# EasyEDA Pro project luq_board.eprj, schematic SCH1
Create Date: 2024-01-28; Page Name: P1; Project Name: luq_board; Schematic Name: SCH1; Update Date: 2024-04-09; Drawed: luq; Page Size: A4; Version: V2.0
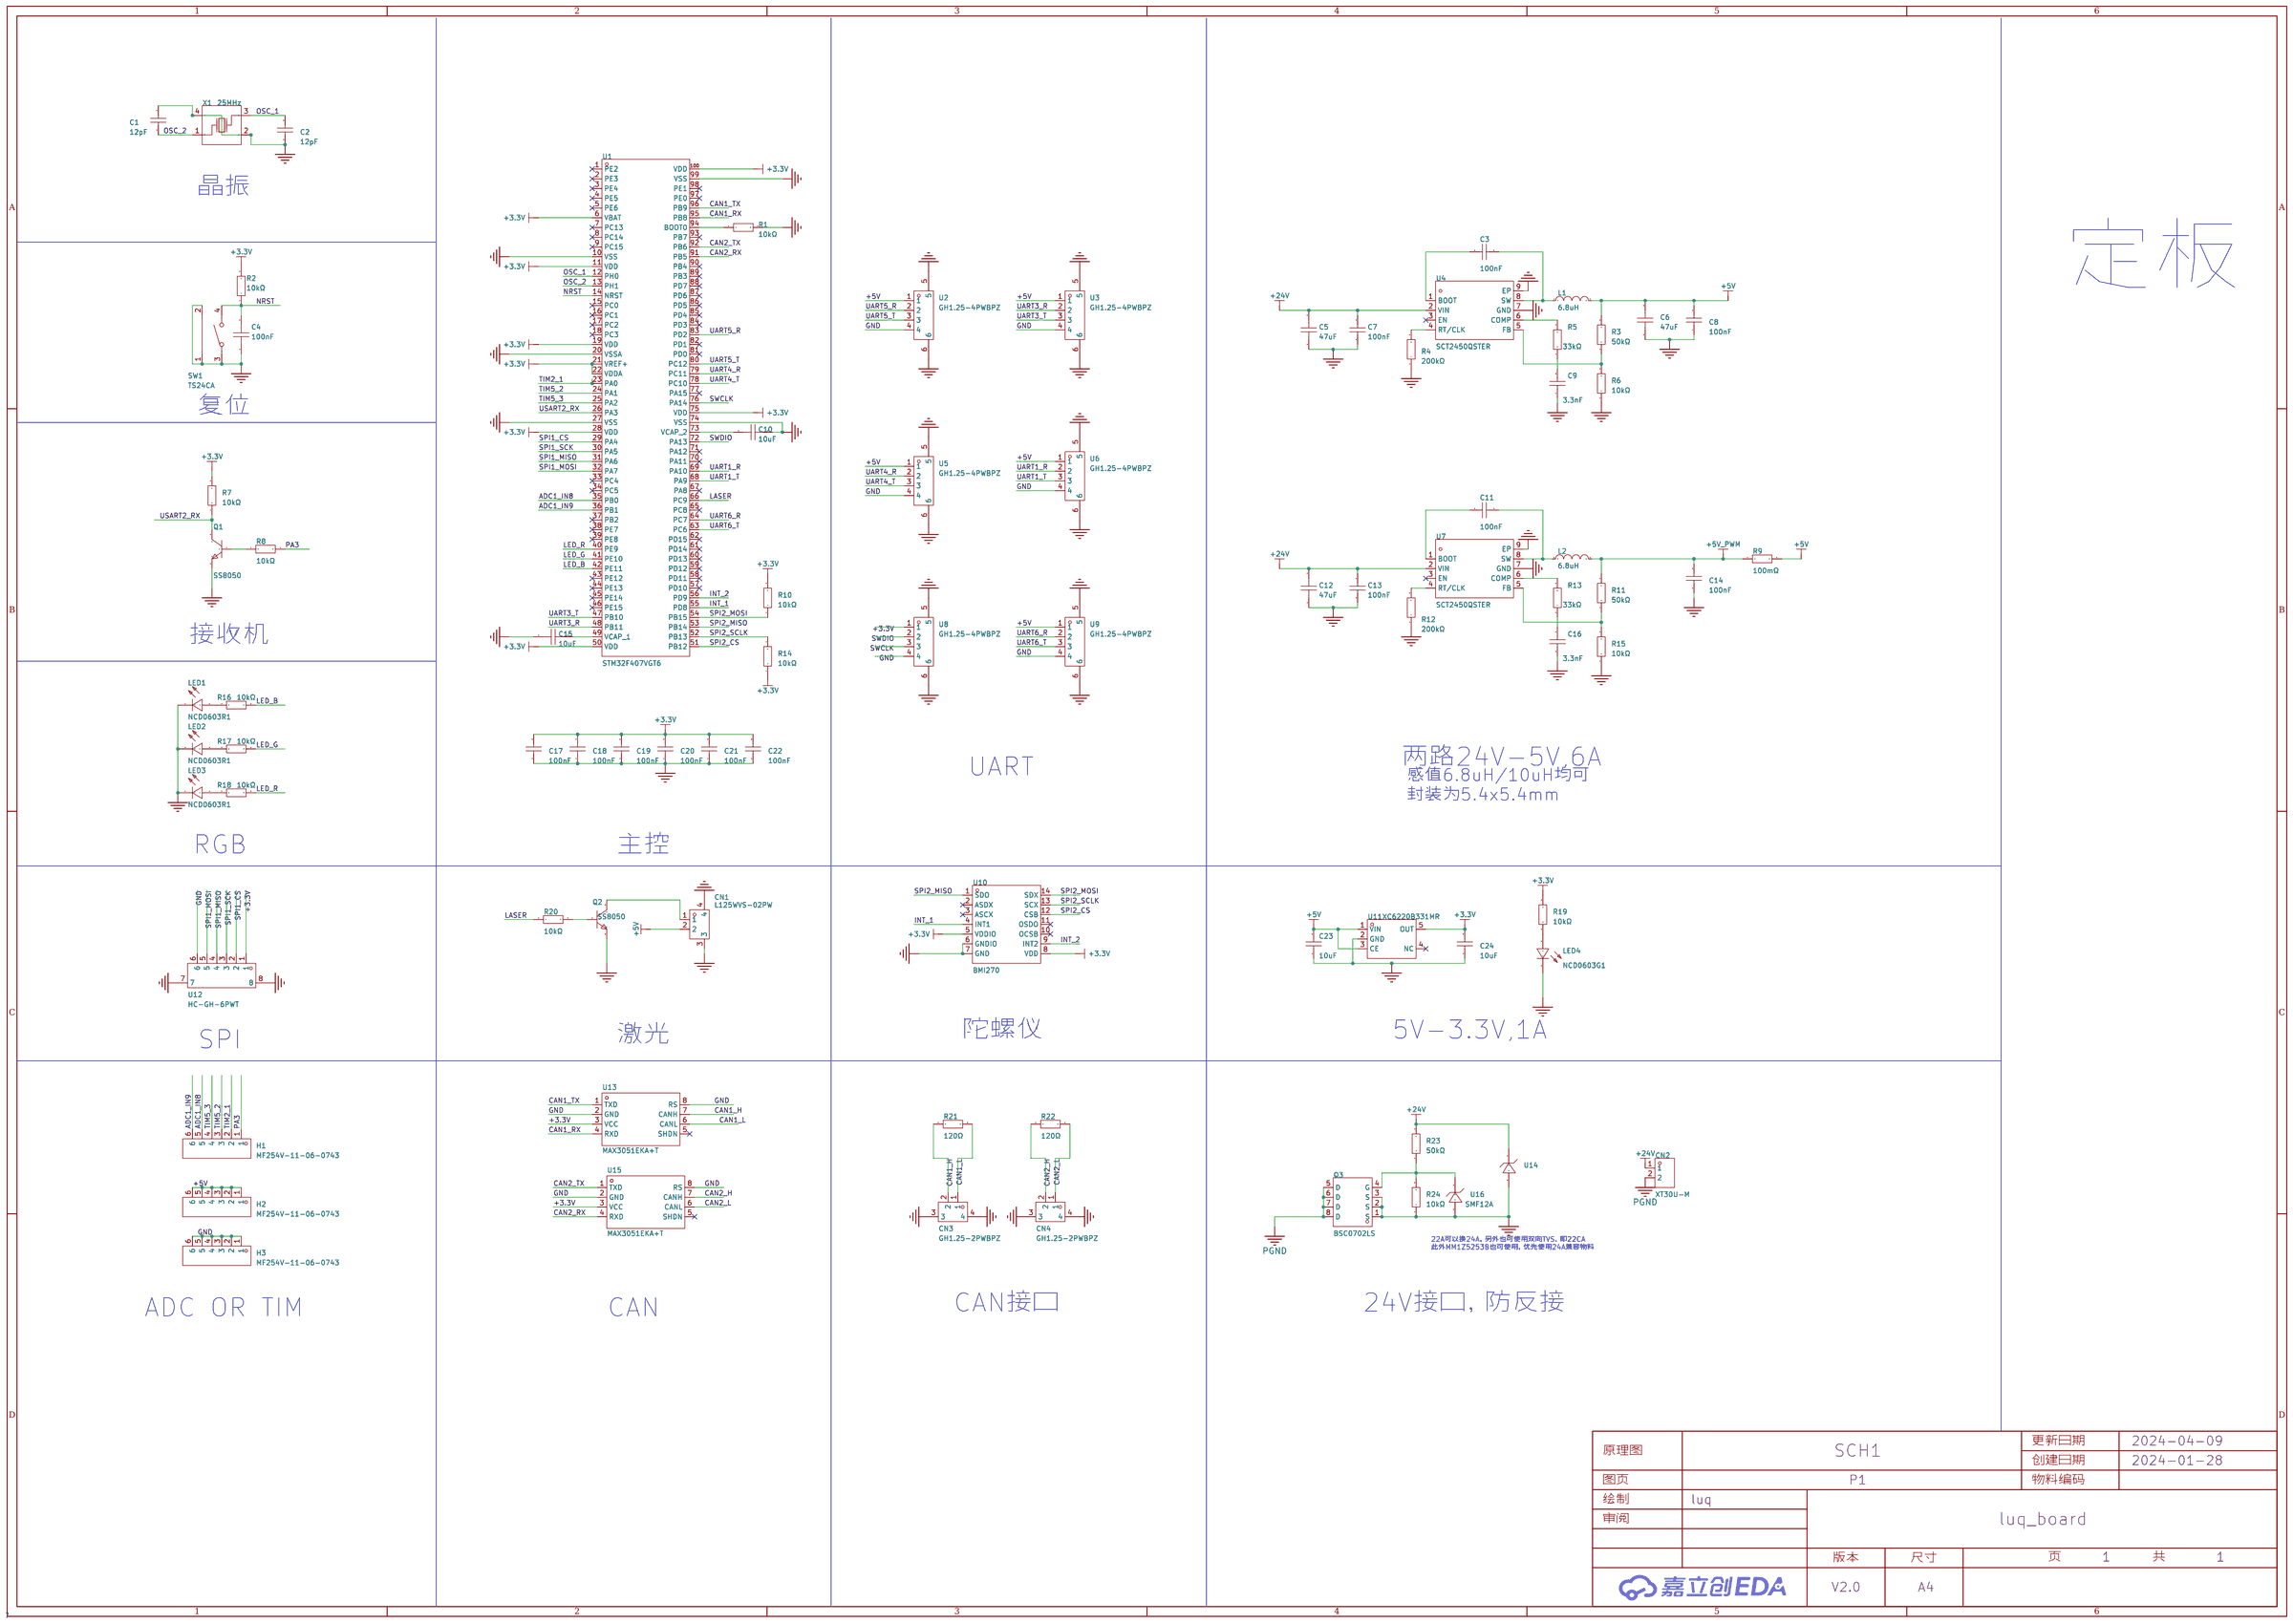
[diagram p0: schematic sheet]

## Parts
C1  12pF  [C0603]
C2  12pF  [C0603]
C3  100nF  [C0603]
C4  100nF  [C0603]
C5  47uF  [C1206]
C6  47uF  [C1206]
C7  100nF  [C0603]
C8  100nF  [C0603]
C9  3.3nF  [C0603]
C10  10uF  [C0603]
C11  100nF  [C0603]
C12  47uF  [C1206]
C13  100nF  [C0603]
C14  100nF  [C0603]
C15  10uF  [C0603]
C16  3.3nF  [C0603]
C17  100nF  [C0603]
C18  100nF  [C0603]
C19  100nF  [C0603]
C20  100nF  [C0603]
C21  100nF  [C0603]
C22  100nF  [C0603]
C23  10uF  [C0603]
C24  10uF  [C0603]
CN1  L125WVS-02PW  [CONN-SMD_2P-P1.25_DELON_L125WVS-02PW]
CN2  XT30U-M  [CONN-TH_XT30U-M]
CN3  GH1.25-2PWBPZ  [CONN-SMD_GH1.25-2PWBPZ]
CN4  GH1.25-2PWBPZ  [CONN-SMD_GH1.25-2PWBPZ]
H1  MF254V-11-06-0743  [HDR-TH_6P-P2.54-V-F_MF254V-11-06-0743]
H2  MF254V-11-06-0743  [HDR-TH_6P-P2.54-V-F_MF254V-11-06-0743]
H3  MF254V-11-06-0743  [HDR-TH_6P-P2.54-V-F_MF254V-11-06-0743]
L1  6.8uH  [IND-SMD_L5.4-W5.2_FXL0530]
L2  6.8uH  [IND-SMD_L5.4-W5.2_FXL0530]
LED1  NCD0603R1  [LED0603-RD_RED]
LED2  NCD0603R1  [LED0603-RD_RED]
LED3  NCD0603R1  [LED0603-RD_RED]
LED4  NCD0603G1  [LED0603-RD]
Q1  SS8050  [S8050_SOT-23]
Q2  SS8050  [S8050_SOT-23]
Q3  BSC0702LS  [PG-TDSON-8_L5.0-W6.0-P1.27-BL-EP]
R1  10kΩ  [R0603]
R2  10kΩ  [R0603]
R3  50kΩ  [R0603]
R4  200kΩ  [R0603]
R5  33kΩ  [R0603]
R6  10kΩ  [R0603]
R7  10kΩ  [R0603]
R8  10kΩ  [R0603]
R9  100mΩ  [R1206]
R10  10kΩ  [R0603]
R11  50kΩ  [R0603]
R12  200kΩ  [R0603]
R13  33kΩ  [R0603]
R14  10kΩ  [R0603]
R15  10kΩ  [R0603]
R16  10kΩ  [R0603]
R17  10kΩ  [R0603]
R18  10kΩ  [R0603]
R19  10kΩ  [R0603]
R20  10kΩ  [R0603]
R21  120Ω  [R0603]
R22  120Ω  [R0603]
R23  50kΩ  [R0603]
R24  10kΩ  [R0603]
SW1  TS24CA  [SW-SMD_TS24CA]
U1  STM32F407VGT6  [LQFP-100_L14.0-W14.0-P0.50-LS16.0-BL]
U2  GH1.25-4PWBPZ  [CONN-SMD_GH1.25-4PWBPZ]
U3  GH1.25-4PWBPZ  [CONN-SMD_GH1.25-4PWBPZ]
U4  SCT2450QSTER  [ESOP-8_L4.9-W3.9-P1.27-LS6.0-BL-EP]
U5  GH1.25-4PWBPZ  [CONN-SMD_GH1.25-4PWBPZ]
U6  GH1.25-4PWBPZ  [CONN-SMD_GH1.25-4PWBPZ]
U7  SCT2450QSTER  [ESOP-8_L4.9-W3.9-P1.27-LS6.0-BL-EP]
U8  GH1.25-4PWBPZ  [CONN-SMD_GH1.25-4PWBPZ]
U9  GH1.25-4PWBPZ  [CONN-SMD_GH1.25-4PWBPZ]
U10  BMI270  [LGA-14_L3.0-W2.5-P0.50-BR]
U11  XC6220B331MR  [SOT-23-5_L2.9-W1.6-P0.95-LS2.8-BR]
U12  HC-GH-6PWT  [CONN-SMD_6P-P1.25_HCTL_HC-GH-6PWT]
U13  MAX3051EKA+T  [SOT-23-8_L3.0-W1.7-P0.65-LS2.8-TL]
U14  SMF22A  [SOD-123FL_L2.8-W1.9-LS3.7-RD]
U15  MAX3051EKA+T  [SOT-23-8_L3.0-W1.7-P0.65-LS2.8-TL]
U16  SMF12A  [SOD-123FL_L2.7-W1.8-LS3.7-RD]
X1  25MHz  [OSC-SMD_4P-L3.2-W2.5-BL]

## Library data of the parts
C1 C2 = CL10C120JB8NNNC: 容值:12pF;精度:±5%;额定电压:50V;材质(温度系数):C0G;; LCSC Part Name: 12pF ±5% 50V; Supplier Part: C38523; Manufacturer: SAMSUNG(三星); Supplier Footprint: 0603; JLCPCB Part Class: 基础库; Datasheet: https://atta.szlcsc.com/upload/public/pdf/source/20160218/1457707763339.pdf; Supplier: LCSC; Tolerance: ±5%; Voltage Rated: 50V; Temperature Coefficient: C0G
C3 C7 C8 C11 C13 C14 C17-C22 = CC0603KRX7R9BB104: 容值:100nF;精度:±10%;额定电压:50V;材质(温度系数):X7R;; LCSC Part Name: 100nF ±10% 50V; Supplier Part: C14663; Manufacturer: YAGEO(国巨); Supplier Footprint: 0603; JLCPCB Part Class: Basic Part; Datasheet: https://atta.szlcsc.com/upload/public/pdf/source/20180910/C282072_33301C7F631E79921B82A8DAC6BCC5B3.pdf; Supplier: LCSC; Tolerance: ±10%; Voltage Rated: 50V; Temperature Coefficient: X7R
C4 = CC0603KRX7R9BB104: 容值:100nF;精度:±10%;额定电压:50V;材质(温度系数):X7R;; LCSC Part Name: 100nF ±10% 50V; Supplier Part: C14663; Manufacturer: YAGEO(国巨); Supplier Footprint: 0603; JLCPCB Part Class: 基础库; Datasheet: https://atta.szlcsc.com/upload/public/pdf/source/20180910/C282072_33301C7F631E79921B82A8DAC6BCC5B3.pdf; Supplier: LCSC; Tolerance: ±10%; Voltage Rated: 50V; Temperature Coefficient: X7R
C5 C6 C12 = GRM31CR61E476ME44L: 容值:47uF;精度:±20%;额定电压:25V;材质(温度系数):X5R;; LCSC Part Name: 47uF ±20% 25V; Supplier Part: C403725; Manufacturer: muRata(村田); Supplier Footprint: 1206; JLCPCB Part Class: Extended Part; Datasheet: https://atta.szlcsc.com/upload/public/pdf/source/20191025/C403725_B8A8CD2FFA1F57E6FDF268BD106459D5.pdf; Supplier: LCSC; Tolerance: ±20%; Voltage Rated: 25V; Temperature Coefficient: X5R
C9 C16 = CC0603KRX7R9BB332: 容值:3.3nF;精度:±10%;额定电压:50V;材质(温度系数):X7R;; LCSC Part Name: 3.3nF ±10% 50V; Supplier Part: C107088; Manufacturer: YAGEO(国巨); Supplier Footprint: 0603; JLCPCB Part Class: Extended Part; Datasheet: https://atta.szlcsc.com/upload/public/pdf/source/20180910/C282072_33301C7F631E79921B82A8DAC6BCC5B3.pdf; Supplier: LCSC; Tolerance: ±10%; Voltage Rated: 50V; Temperature Coefficient: X7R
C10 C15 C23 C24 = CL10A106MA8NRNC: 容值:10uF;精度:±20%;额定电压:25V;材质(温度系数):X5R;; LCSC Part Name: 10uF ±20% 25V; Supplier Part: C96446; Manufacturer: SAMSUNG(三星); Supplier Footprint: 0603; JLCPCB Part Class: Basic Part; Datasheet: https://atta.szlcsc.com/upload/public/pdf/source/20160218/1457707763339.pdf; Supplier: LCSC; Tolerance: ±20%; Voltage Rated: 25V; Temperature Coefficient: X5R
CN1 = L125WVS-02PW: 插针结构:1x2P;间距:1.25mm;公母:公;安装方式:卧贴;排数:1;每排PIN数:2;额定电流:1A;工作温度范围:-40℃~+110℃;; LCSC Part Name: 1x2P 间距:1.25mm 卧贴 GH1.25间距卧式贴片 2P 连接器; Supplier Part: C2998790; Manufacturer: DEALON(德艺隆); Supplier Footprint: SMD,P=1.25mm; JLCPCB Part Class: 扩展库; Datasheet: https://atta.szlcsc.com/upload/public/pdf/source/20220425/50B09E6409C3A2782C6D65104D18E34A.pdf; Supplier: LCSC; Pins Structure: 1x2P; Pitch: 1.25mm; Gender: 公; Mounting Style: 卧贴; Number of Rows: 1; Number of PINs Per Row: 2; Current Rating (Max): 1A; Operating Temperature Range: -40℃~+110℃
CN2 = XT30U-M: 模型插头轻量版锂电池插头; LCSC Part Name: AMASS(艾迈斯)轻量版锂电池插头公头 XT30U-M; Supplier Part: C99101; Manufacturer: AMASS(艾迈斯); JLCPCB Part Class: 扩展库; Datasheet: https://atta.szlcsc.com/upload/public/pdf/source/20170606/1496716542582.pdf; Supplier: LCSC
CN3 CN4 = GH1.25-2PWBPZ: LCSC Part Name: GH1.25-2P卧贴编带; Supplier Part: C2829251; Manufacturer: BOOMELE(博穆精密); JLCPCB Part Class: 扩展库; Datasheet: https://atta.szlcsc.com/upload/public/pdf/source/20211125/08A09A4909F58AF780B71FE423A00F7E.pdf; Supplier: LCSC
H1-H3 = MF254V-11-06-0743: 排数:单排;总孔位数:6P;间距:2.54mm;插孔结构:1x6P;行距:-;安装类型:直插;圆孔/方孔:圆孔;额定电流:3A;额定电压:60V;插孔方向:顶部;塑高:3mm;工作温度范围:-40℃~+105℃;; LCSC Part Name: 间距:2.54mm 1x6P 直插; Supplier Part: C962325; Manufacturer: XFCN(兴飞); Supplier Footprint: 插件,P=2.54mm; JLCPCB Part Class: 扩展库; Datasheet: https://atta.szlcsc.com/upload/public/pdf/source/20200408/C510959_8640BFA72E43E78C14C3EAA65BA5C05B.pdf; Supplier: LCSC; Number of Rows: 单排; Number of Holes: 6P; Pitch: 2.54mm; Holes Structure: 1x6P; Mounting Type: 直插; Circular Hole / Square Hole: 圆孔; Current Rating (Max): 3A; Voltage Rating (Max): 60V; Holes Direction: 顶部; Insulation Height: 3mm; Operating Temperature Range: -40℃~+105℃
L1 L2 = FXL0530-6R8-M: 电感值:6.8uH;精度:±20%;额定电流:3.5A;类型:一体成型电感;饱和电流(Isat):4A;; LCSC Part Name: 6.8uH ±20% 4A; Supplier Part: C177249; Manufacturer: cjiang(长江微电); Supplier Footprint: SMD,5.2x5.4mm; JLCPCB Part Class: Extended Part; Datasheet: https://atta.szlcsc.com/upload/public/pdf/source/20230516/4BF6F9C76E81720F52A39ED5FFFA18B4.pdf; Supplier: LCSC; Tolerance: ±20%; Rated Current: 3.5A; Type: 一体成型电感; DC Resistance (DCR): 90mΩ; Saturation Current (Isat): 4A
LED1-LED3 = NCD0603R1_C84263: 灯头类型:-;发光颜色:红色;正向电压(VF):1.6V~2.6V;功率:65mW;正向电流:20mA;主波长:615nm~630nm;二极管配置:独立二极管;透镜颜色:无色透明;色温:-;发光强度:80mcd~220mcd;发光角度:130°;载带方式:-;工作温度:-30℃~+85℃;; Supplier Part: C84263; Manufacturer: 国星光电; Supplier Footprint: 0603; JLCPCB Part Class: Extended Part; Datasheet: https://atta.szlcsc.com/upload/public/pdf/source/20200820/C84263_DABC6A75E58F576973B407FDBA283D60.pdf; Supplier: LCSC; Emitted Color: 红色; Forward Voltage (VF): 1.6V~2.6V; Power Dissipation: 65mW; Forward Current: 20mA; Dominant Wavelength: 615nm~630nm; Diode Configuration: 独立二极管; Lens Color: 无色透明; Luminous Intensity: 80mcd~220mcd; Viewing Angle: 130°; Operating Temperature: -30℃~+85℃
LED4 = NCD0603G1: 发光颜色:翠绿色;正向电压(VF):2.6V~3.6V;功率:72mW;正向电流:10mA;主波长:515nm~530nm;透镜颜色:无色透明;发光强度:330mcd~900mcd;发光角度:130°;工作温度:-30℃~+85℃;; Supplier Part: C84267; Manufacturer: 国星光电; Supplier Footprint: 0603; JLCPCB Part Class: 扩展库; Datasheet: https://atta.szlcsc.com/upload/public/pdf/source/20200820/C84267_04BA7703640BAC111D09F5EFB971FBF3.pdf; Supplier: LCSC; Emitted Color: 翠绿色; Forward Voltage (VF): 2.6V~3.6V; Power Dissipation: 72mW; Forward Current: 10mA; Dominant Wavelength: 515nm~530nm; Lens Color: 无色透明; Luminous Intensity: 330mcd~900mcd; Viewing Angle: 130°; Operating Temperature: -30℃~+85℃
Q1 Q2 = SS8050_C2150: 晶体管类型:NPN;集电极电流(Ic):1.5A;集射极击穿电压(Vceo):25V;功率(Pd):300mW;直流电流增益(hFE@Ic,Vce):200@100mA,1V;; LCSC Part Name: SS8050(RANGE:200-350) hfe=200~350; Supplier Part: C2150; Manufacturer: CJ(江苏长电/长晶); Supplier Footprint: SOT-23; JLCPCB Part Class: Basic Part; Datasheet: https://atta.szlcsc.com/upload/public/pdf/source/20230322/AEE86F4B043774EFF80CAEA14A37D9E9.pdf; Supplier: LCSC; Transistor Type: NPN; Collector Current (Ic): 1.5A; Collector-Emitter Breakdown Voltage (Vceo): 25V; Power Dissipation (Pd): 300mW; DC Current Gain (hFE@Ic,Vce): 200@100mA,1V; Transition Frequency (fT): 100MHz; Collector Cut-Off Current (Icbo): 100nA; Collector-Emitter Saturation Voltage (VCE(sat)@Ic,Ib): 500mV@800mA,80mA
Q3 = BSC0702LS: 类型:N沟道;漏源电压(Vdss):60V;连续漏极电流(Id):100A;功率(Pd):83W;导通电阻(RDS(on)@Vgs,Id):2.3mΩ@10V,50A;阈值电压(Vgs(th)@Id):2.3V@49uA;; LCSC Part Name: N沟道 耐压:60V 电流:100A; Supplier Part: C501503; Manufacturer: Infineon(英飞凌); Supplier Footprint: TDSON-8-EP(5x6); JLCPCB Part Class: 扩展库; Datasheet: https://atta.szlcsc.com/upload/public/pdf/source/20200324/C501503_BE3C55BAEEDCAD77F3934BFEE5415F86.pdf; Supplier: LCSC; Type: N沟道; Drain Source Voltage (Vdss): 60V; Continuous Drain Current (Id): 100A; Power Dissipation (Pd): 83W; Drain Source On Resistance (RDS(on)@Vgs,Id): 2.3mΩ@10V,50A; Gate Threshold Voltage (Vgs(th)@Id): 2.3V@49uA
R1 R2 = 0603WAF1002T5E: 电阻类型:厚膜电阻;阻值:10kΩ;精度:±1%;功率:100mW;最大工作电压:75V;温度系数:±100ppm/℃;; LCSC Part Name: 10kΩ ±1% 100mW 厚膜电阻; Supplier Part: C25804; Manufacturer: UNI-ROYAL(厚声); Supplier Footprint: 0603; JLCPCB Part Class: 基础库; Datasheet: https://atta.szlcsc.com/upload/public/pdf/source/20200306/C422600_1E6D84923E4A46A82E41ADD87F860B5C.pdf; Supplier: LCSC; Type: 厚膜电阻; Tolerance: ±1%; Power(Watts): 100mW; Overload Voltage (Max): 75V; Temperature Coefficient: ±100ppm/℃; Operating Temperature Range: -55℃~+155℃
R3 R11 R23 = AR03BTC5002A: 阻值:50kΩ;精度:±0.1%;功率:62.5mW;; LCSC Part Name: 50kΩ ±0.1% 62.5mW; Supplier Part: C304067; Manufacturer: Viking(光颉); Supplier Footprint: 0603; JLCPCB Part Class: Extended Part; Datasheet: https://atta.szlcsc.com/upload/public/pdf/source/20180929/C304067_C6C1AA1A73175DF88A934A2863C540D5.pdf; Supplier: LCSC; Tolerance: ±0.1%; Power(Watts): 62.5mW; Temperature Coefficient: ±25ppm/℃
R4 R12 = 0603WAF2003T5E: 阻值:200kΩ;精度:±1%;功率:100mW;温度系数:±100ppm/℃;电阻类型:厚膜电阻;; LCSC Part Name: 200kΩ ±1% 100mW 厚膜电阻; Supplier Part: C25811; Manufacturer: UNI-ROYAL(厚声); Supplier Footprint: 0603; JLCPCB Part Class: 基础库; Datasheet: https://atta.szlcsc.com/upload/public/pdf/source/20200306/C422600_1E6D84923E4A46A82E41ADD87F860B5C.pdf; Supplier: LCSC; Tolerance: ±1%; Power(Watts): 100mW; Overload Voltage (Max): 75V; Temperature Coefficient: ±100ppm/℃; Type: 厚膜电阻; Operating Temperature Range: -55℃~+155℃
R5 R13 = 0603WAF3302T5E: 阻值:33kΩ;精度:±1%;功率:100mW;温度系数:±100ppm/℃;电阻类型:厚膜电阻;; LCSC Part Name: 33kΩ ±1% 100mW 厚膜电阻; Supplier Part: C4216; Manufacturer: UNI-ROYAL(厚声); Supplier Footprint: 0603; JLCPCB Part Class: Basic Part; Datasheet: https://atta.szlcsc.com/upload/public/pdf/source/20200306/C422600_1E6D84923E4A46A82E41ADD87F860B5C.pdf; Supplier: LCSC; Tolerance: ±1%; Power(Watts): 100mW; Overload Voltage (Max): 75V; Temperature Coefficient: ±100ppm/℃; Type: 厚膜电阻; Operating Temperature Range: -55℃~+155℃
R6-R8 R10 R14-R20 R24 = 0603WAF1002T5E: 电阻类型:厚膜电阻;阻值:10kΩ;精度:±1%;功率:100mW;最大工作电压:75V;温度系数:±100ppm/℃;; LCSC Part Name: 厚膜电阻 10kΩ ±1% 100mW; Supplier Part: C25804; Manufacturer: UNI-ROYAL(厚声); Supplier Footprint: 0603; JLCPCB Part Class: Basic Part; Datasheet: https://atta.szlcsc.com/upload/public/pdf/source/20200306/C422600_1E6D84923E4A46A82E41ADD87F860B5C.pdf; Supplier: LCSC; Type: 厚膜电阻; Tolerance: ±1%; Power(Watts): 100mW; Overload Voltage (Max): 75V; Temperature Coefficient: ±100ppm/℃; Operating Temperature Range: -55℃~+155℃
R9 = 1206W4F100LT5E: 电阻类型:厚膜电阻;阻值:100mΩ;精度:±1%;功率:250mW;最大工作电压:200V;温度系数:±800ppm/℃;; LCSC Part Name: 100mΩ ±1% 250mW 厚膜电阻; Supplier Part: C25334; Manufacturer: UNI-ROYAL(厚声); Supplier Footprint: 1206; JLCPCB Part Class: Basic Part; Datasheet: https://atta.szlcsc.com/upload/public/pdf/source/20200306/C422600_1E6D84923E4A46A82E41ADD87F860B5C.pdf; Supplier: LCSC; Type: 厚膜电阻; Tolerance: ±1%; Power(Watts): 250mW; Overload Voltage (Max): 200V; Temperature Coefficient: ±800ppm/℃; Operating Temperature Range: -55℃~+155℃
R21 R22 = 0603WAF1200T5E: 电阻类型:厚膜电阻;阻值:120Ω;精度:±1%;功率:100mW;最大工作电压:75V;温度系数:±100ppm/℃;; LCSC Part Name: 120Ω ±1% 100mW 厚膜电阻; Supplier Part: C22787; Manufacturer: UNI-ROYAL(厚声); Supplier Footprint: 0603; JLCPCB Part Class: Basic Part; Datasheet: https://atta.szlcsc.com/upload/public/pdf/source/20200306/C422600_1E6D84923E4A46A82E41ADD87F860B5C.pdf; Supplier: LCSC; Type: 厚膜电阻; Tolerance: ±1%; Power(Watts): 100mW; Overload Voltage (Max): 75V; Temperature Coefficient: ±100ppm/℃; Operating Temperature Range: -55℃~+155℃
SW1 = TS24CA: 触点电流:50mA;额定电压(DC):12V;电路结构:单刀单掷;安装方式:卧贴;带灯:-;机械寿命:-;; LCSC Part Name: 4.55*1.8*3.5mm 卧贴 轻触开关; Supplier Part: C393942; Manufacturer: SHOU HAN(首韩); Supplier Footprint: SMD; JLCPCB Part Class: 扩展库; Datasheet: https://atta.szlcsc.com/upload/public/pdf/source/20190521/C393942_591A9E318887EFA4274D34029981AD99.pdf; Supplier: LCSC; Contact Current: 50mA; Voltage Rating (DC): 12V; Circuit: 单刀单掷; Mounting Style: 卧贴; Actuator Style: 矩形按钮; Switch Length: 4.55mm; Switch Width: 1.8mm; Switch Height: 3.5mm
U1 = STM32F407VGT6: CPU内核:ARM Cortex-M4;CPU最大主频:168MHz;工作电压范围:1.8V~3.6V;程序存储容量:1MB;程序存储器类型:FLASH;RAM总容量:192KB;GPIO端口数量:82;; Supplier Part: C12345; Manufacturer: ST(意法半导体); Supplier Footprint: LQFP-100(14x14); JLCPCB Part Class: 扩展库; Datasheet: https://atta.szlcsc.com/upload/public/pdf/source/20140801/1457707197138.pdf; Supplier: LCSC; CPU Core: ARM Cortex-M4; CPU Maximum Speed: 168MHz; Operating Voltage Range: 1.8V~3.6V; Program Storage Size: 1MB; Program Memory Type: FLASH; RAM Size: 192KB; GPIO Ports Number: 82; ADC (Bit): 12bit; DAC (Bit): 12bit; Universal Serial Bus: 有; Peripheral/Function: DMA；LCD/LED驱动; Watchdog: 有; Infrared Data Association: 有; Low-Voltage Detect: 有; LCD Module: 有; Direct Memory Access: 有; Internal Oscillator: 有; Operating Temperature Range: -40℃~+85℃
U2 U3 U5 U6 U8 U9 = GH1.25-4PWBPZ: LCSC Part Name: GH1.25-4P卧贴编带; Supplier Part: C2829253; Manufacturer: BOOMELE(博穆精密); JLCPCB Part Class: 扩展库; Datasheet: https://atta.szlcsc.com/upload/public/pdf/source/20211125/08A09A4909F58AF780B71FE423A00F7E.pdf; Supplier: LCSC
U4 U7 = SCT2450QSTER: DCDC降压变换器; Supplier Part: C2929524; Manufacturer: SCT(芯洲科技); Supplier Footprint: ESOP-8; JLCPCB Part Class: 扩展库; Datasheet: https://atta.szlcsc.com/upload/public/pdf/source/20211215/931D8B56C9B2E8CCF51B671F286E63AF.pdf; Supplier: LCSC
U10 = BMI270: IMU-惯性测量单元; Supplier Part: C2836813; Manufacturer: Bosch(博世); Supplier Footprint: LGA-14(2.5x3); JLCPCB Part Class: 扩展库; Datasheet: https://atta.szlcsc.com/upload/public/pdf/source/20210625/C2836813_35E1F3F92097F45A3828DF13DDBA01A5.pdf; Supplier: LCSC
U11 = XC6220B331MR: Supplier Part: C3040644; Manufacturer: TECH PUBLIC(台舟); Supplier Footprint: SOT-23-5; JLCPCB Part Class: Extended Part; Datasheet: https://atta.szlcsc.com/upload/public/pdf/source/20220630/EC7D0F989934709C5AE69B489B953B17.pdf; Supplier: LCSC
U12 = HC-GH-6PWT: 插针结构:1x6P;间距:1.25mm;公母:公;安装方式:卧贴;排数:1;每排PIN数:6;参考系列:GH;额定电流:1A;工作温度范围:-25℃~+85℃;; LCSC Part Name: 1x6P 间距:1.25mm 卧贴 系列:GH 卧式贴片带扣 镀锡 6P; Supplier Part: C3011948; Manufacturer: HCTL(华灿天禄); Supplier Footprint: SMD,P=1.25mm; JLCPCB Part Class: 扩展库; Datasheet: https://atta.szlcsc.com/upload/public/pdf/source/20210728/C2845397_2BAB5616F3DD52263F1EF5392BF0F2D4.pdf; Supplier: LCSC; Pins Structure: 1x6P; Pitch: 1.25mm; Gender: 公; Mounting Style: 卧贴; Number of Rows: 1; Number of PINs Per Row: 6; Reference Series: GH; Current Rating (Max): 1A; Operating Temperature Range: -25℃~+85℃
U13 U15 = MAX3051EKA+T: 类型:收发器;数据速率:1Mbps;; LCSC Part Name: 1Mbps 3.14V~3.47V; Supplier Part: C112005; Manufacturer: ADI(亚德诺); Supplier Footprint: SOT-23-8; JLCPCB Part Class: 扩展库; Datasheet: https://atta.szlcsc.com/upload/public/pdf/source/20171014/C112005_15079752662991037925.pdf; Supplier: LCSC; Type: 收发器; Data Rate: 1Mbps; Supply Voltage: 3.14V~3.47V
U14 = SMF22A_C2943862: 反向截止电压(Vrwm):22V;最大钳位电压:35.5V;峰值脉冲电流(Ipp)@10/1000us:5.6A;击穿电压:24.4V;; Supplier Part: C2943862; Manufacturer: GOODWORK(固得沃克); Supplier Footprint: SOD-123FL; JLCPCB Part Class: 扩展库; Datasheet: https://atta.szlcsc.com/upload/public/pdf/source/20220524/AA0A0E50DAB96579C66583AA0A8CF024.pdf; Supplier: LCSC; Reverse Stand-Off Voltage (Vrwm): 22V; Maximum Clamping Voltage: 35.5V; Peak Pulse Current (Ipp)@10/1000us: 5.6A; Breakdown Voltage: 24.4V; Reverse Leakage Current (Ir): 1uA
U16 = SMF12A_C2943870: 反向截止电压(Vrwm):12V;最大钳位电压:19.9V;峰值脉冲电流(Ipp)@10/1000us:10.1A;击穿电压:13.3V;; Supplier Part: C2943870; Manufacturer: GOODWORK(固得沃克); Supplier Footprint: SOD-123FL; JLCPCB Part Class: 扩展库; Datasheet: https://atta.szlcsc.com/upload/public/pdf/source/20220524/AA0A0E50DAB96579C66583AA0A8CF024.pdf; Supplier: LCSC; Reverse Stand-Off Voltage (Vrwm): 12V; Maximum Clamping Voltage: 19.9V; Peak Pulse Current (Ipp)@10/1000us: 10.1A; Breakdown Voltage: 13.3V; Reverse Leakage Current (Ir): 2.5uA
X1 = X322525MOB4SI: 频率:25MHz;负载电容:12pF;频率公差:±10ppm;; LCSC Part Name: 25MHz ±10ppm 12pF YSX321SL; Supplier Part: C9006; Manufacturer: YXC(扬兴晶振); Supplier Footprint: SMD3225-4P; JLCPCB Part Class: 基础库; Datasheet: https://atta.szlcsc.com/upload/public/pdf/source/20210329/C112971_1F611BDC486E193C1706F6D8EB5AA189.pdf; Supplier: LCSC; Crystal Type: 贴片无源晶振; Load Capacitance: 12pF; Frequency Tolerance: ±10ppm; Frequency Stability: ±30ppm; Operating Temperature: -40℃~+85℃

## Nets
+3.3V: C17.2 C18.2 C19.2 C20.2 C21.2 C22.2 C24.2 R2.2 R7.2 R10.2 R14.1 R19.2 U1.6(VBAT) U1.11(VDD) U1.19(VDD) U1.21(VREF+) U1.22(VDDA) U1.28(VDD) U1.50(VDD) U1.75(VDD) U1.100(VDD) U8.1 U10.5(VDDIO) U10.8(VDD) U11.5(OUT) U12.1 U13.3(VCC) U15.3(VCC)
+5V: C6.2 C8.2 C23.2 CN1.2 H2.1 H2.2 H2.3 H2.4 H2.5 H2.6 L1.2 R3.2 R9.2 U2.1 U3.1 U5.1 U6.1 U9.1 U11.1(VIN) U11.3(CE)
+5V_PWM: C14.2 L2.2 R9.1 R11.2
+24V: C5.2 C7.2 C12.2 C13.2 CN2.1 R23.2 U4.2(VIN) U7.2(VIN) U14.1(C)
GND: C1.2 C2.1 C4.1 C5.1 C6.1 C7.1 C8.1 C9.1 C10.2 C12.1 C13.1 C14.1 C15.1 C16.1 C17.1 C18.1 C19.1 C20.1 C21.1 C22.1 C23.1 C24.1 CN1.3 CN1.4 CN3.3 CN3.4 CN4.3 CN4.4 H3.1 H3.2 H3.3 H3.4 H3.5 H3.6 LED1.1(K) LED2.1(K) LED3.1(K) LED4.1(K) Q1.2 Q2.2 Q3.1(S) Q3.2(S) Q3.3(S) R1.2 R4.1 R6.1 R12.1 R15.1 R24.1 SW1.1 SW1.2 SW1.3 U1.10(VSS) U1.20(VSSA) U1.27(VSS) U1.74(VSS) U1.99(VSS) U2.4 U2.5 U2.6 U3.4 U3.5 U3.6 U4.7(GND) U4.9(EP) U5.4 U5.5 U5.6 U6.4 U6.5 U6.6 U7.7(GND) U7.9(EP) U8.4 U8.5 U8.6 U9.4 U9.5 U9.6 U10.6(GNDIO) U10.7(GND) U11.2(GND) U12.6 U12.7 U12.8 U13.2(GND) U13.8(RS) U14.2(A) U15.2(GND) U15.8(RS) U16.2(A) X1.2(GND) X1.4(GND)
PGND: CN2.2 Q3.5(D) Q3.6(D) Q3.7(D) Q3.8(D)
ADC1_IN8: H1.5 U1.35(PB0)
ADC1_IN9: H1.6 U1.36(PB1)
CAN1_H: CN3.2 R21.1 U13.7(CANH)
CAN1_L: CN3.1 R21.2 U13.6(CANL)
CAN1_RX: U1.95(PB8) U13.4(RXD)
CAN1_TX: U1.96(PB9) U13.1(TXD)
CAN2_H: CN4.2 R22.1 U15.7(CANH)
CAN2_L: CN4.1 R22.2 U15.6(CANL)
CAN2_RX: U1.91(PB5) U15.4(RXD)
CAN2_TX: U1.92(PB6) U15.1(TXD)
INT_1: U1.55(PD8) U10.4(INT1)
INT_2: U1.56(PD9) U10.9(INT2)
LASER: R20.1 U1.66(PC9)
LED_B: R16.2 U1.42(PE11)
LED_G: R17.2 U1.41(PE10)
LED_R: R18.2 U1.40(PE9)
NRST: C4.2 R2.1 SW1.4 U1.14(NRST)
OSC_1: C2.2 U1.12(PH0) X1.3(OSC2)
OSC_2: C1.1 U1.13(PH1) X1.1(OSC1)
PA3: H1.1 R8.2
SPI1_CS: U1.29(PA4) U12.2
SPI1_MISO: U1.31(PA6) U12.4
SPI1_MOSI: U1.32(PA7) U12.5
SPI1_SCK: U1.30(PA5) U12.3
SPI2_CS: U1.51(PB12) U10.12(CSB)
SPI2_MISO: U1.53(PB14) U10.1(SDO)
SPI2_MOSI: R10.1 U1.54(PB15) U10.14(SDX)
SPI2_SCLK: R14.2 U1.52(PB13) U10.13(SCX)
SWCLK: U1.76(PA14) U8.3
SWDIO: U1.72(PA13) U8.2
TIM2_1: H1.2 U1.23(PA0)
TIM5_2: H1.3 U1.24(PA1)
TIM5_3: H1.4 U1.25(PA2)
UART1_R: U1.69(PA10) U6.2
UART1_T: U1.68(PA9) U6.3
UART3_R: U1.48(PB11) U3.2
UART3_T: U1.47(PB10) U3.3
UART4_R: U1.79(PC11) U5.2
UART4_T: U1.78(PC10) U5.3
UART5_R: U1.83(PD2) U2.2
UART5_T: U1.80(PC12) U2.3
UART6_R: U1.64(PC7) U9.2
UART6_T: U1.63(PC6) U9.3
USART2_RX: Q1.3 R7.1 U1.26(PA3)
$C3_1: C3.1 L1.1 U4.8(SW)
$C3_2: C3.2 U4.1(BOOT)
$C9_2: C9.2 R5.1
$C10_1: C10.1 U1.73(VCAP_2)
$C11_1: C11.1 L2.1 U7.8(SW)
$C11_2: C11.2 U7.1(BOOT)
$C15_2: C15.2 U1.49(VCAP_1)
$C16_2: C16.2 R13.1
$CN1_1: CN1.1 Q2.3
$LED1_2: LED1.2(A) R16.1
$LED2_2: LED2.2(A) R17.1
$LED3_2: LED3.2(A) R18.1
$LED4_2: LED4.2(A) R19.1
$Q1_1: Q1.1 R8.1
$Q2_1: Q2.1 R20.2
$Q3_4: Q3.4(G) R23.1 R24.2 U16.1(C)
$R1_1: R1.1 U1.94(BOOT0)
$R3_1: R3.1 R6.2 U4.5(FB)
$R4_2: R4.2 U4.4(RT/CLK)
$R5_2: R5.2 U4.6(COMP)
$R11_1: R11.1 R15.2 U7.5(FB)
$R12_2: R12.2 U7.4(RT/CLK)
$R13_2: R13.2 U7.6(COMP)

Not connected (* = marked no-connect by the designer): U1 1(PE2)* 2(PE3)* 3(PE4)* 4(PE5)* 5(PE6)* 7(PC13)* 8(PC14)* 9(PC15)* 15(PC0)* 16(PC1)* 17(PC2)* 18(PC3)* 33(PC4)* 34(PC5)* 37(PB2)* 38(PE7)* 39(PE8)* 43(PE12)* 44(PE13)* 45(PE14)* 46(PE15)* 57(PD10)* 58(PD11)* 59(PD12)* 60(PD13)* 61(PD14)* 62(PD15)* 65(PC8)* 67(PA8)* 70(PA11)* 71(PA12)* 77(PA15)* 81(PD0)* 82(PD1)* 84(PD3)* 85(PD4)* 86(PD5)* 87(PD6)* 88(PD7)* 89(PB3)* 90(PB4)* 93(PB7)* 97(PE0)* 98(PE1)*; U4 3(EN)*; U7 3(EN)*; U10 2(ASDX)* 3(ASCX)* 10(OCSB)* 11(OSDO)*; U11 4(NC)*; U13 5(SHDN)*; U15 5(SHDN)*

## Notes on the sheet
- 晶振
- 定板
- 复位
- 接收机
- 两路24V-5V,6A
- UART
- 感值6.8uH/10uH均可
  封装为5.4x5.4mm
- RGB
- 主控
- 陀螺仪
- 5V-3.3V,1A
- SPI
- 激光
- 22A可以换24A，另外也可使用双向TVS，即22CA
  此外MM1Z5253B也可使用，优先使用24A兼容物料
- ADC OR TIM
- CAN
- CAN接口
- 24V接口，防反接
